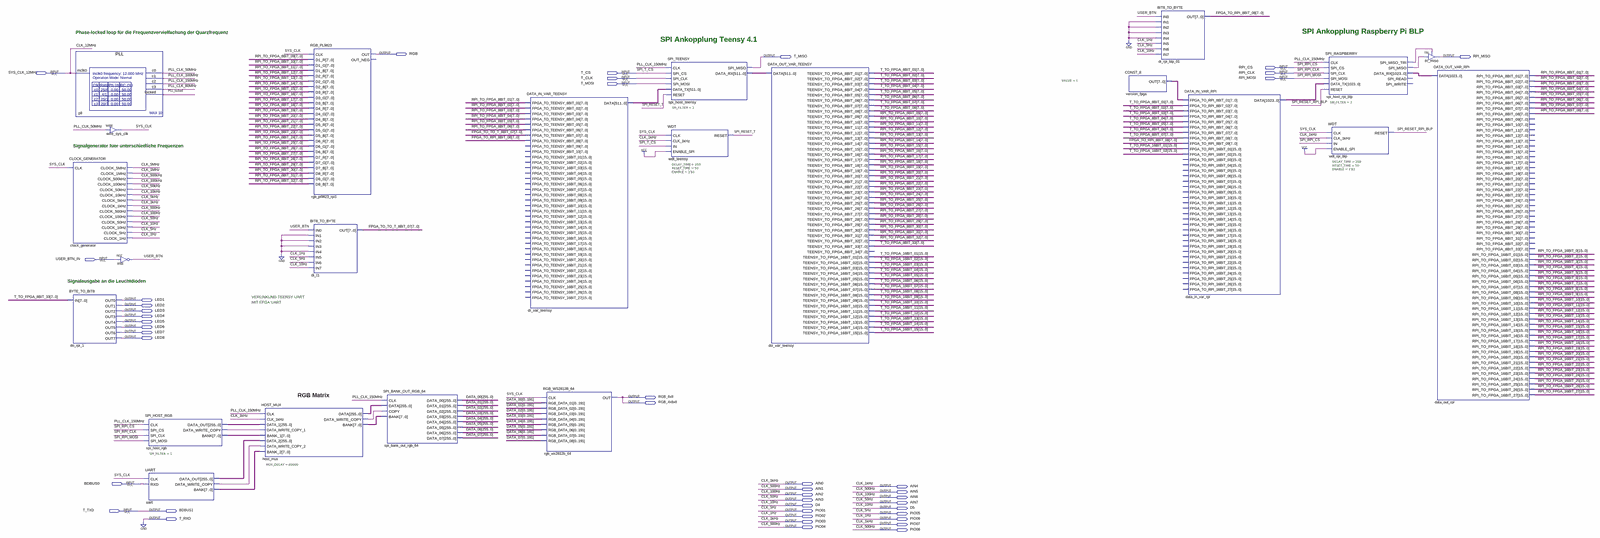
[diagram p0: schematic sheet, whole]
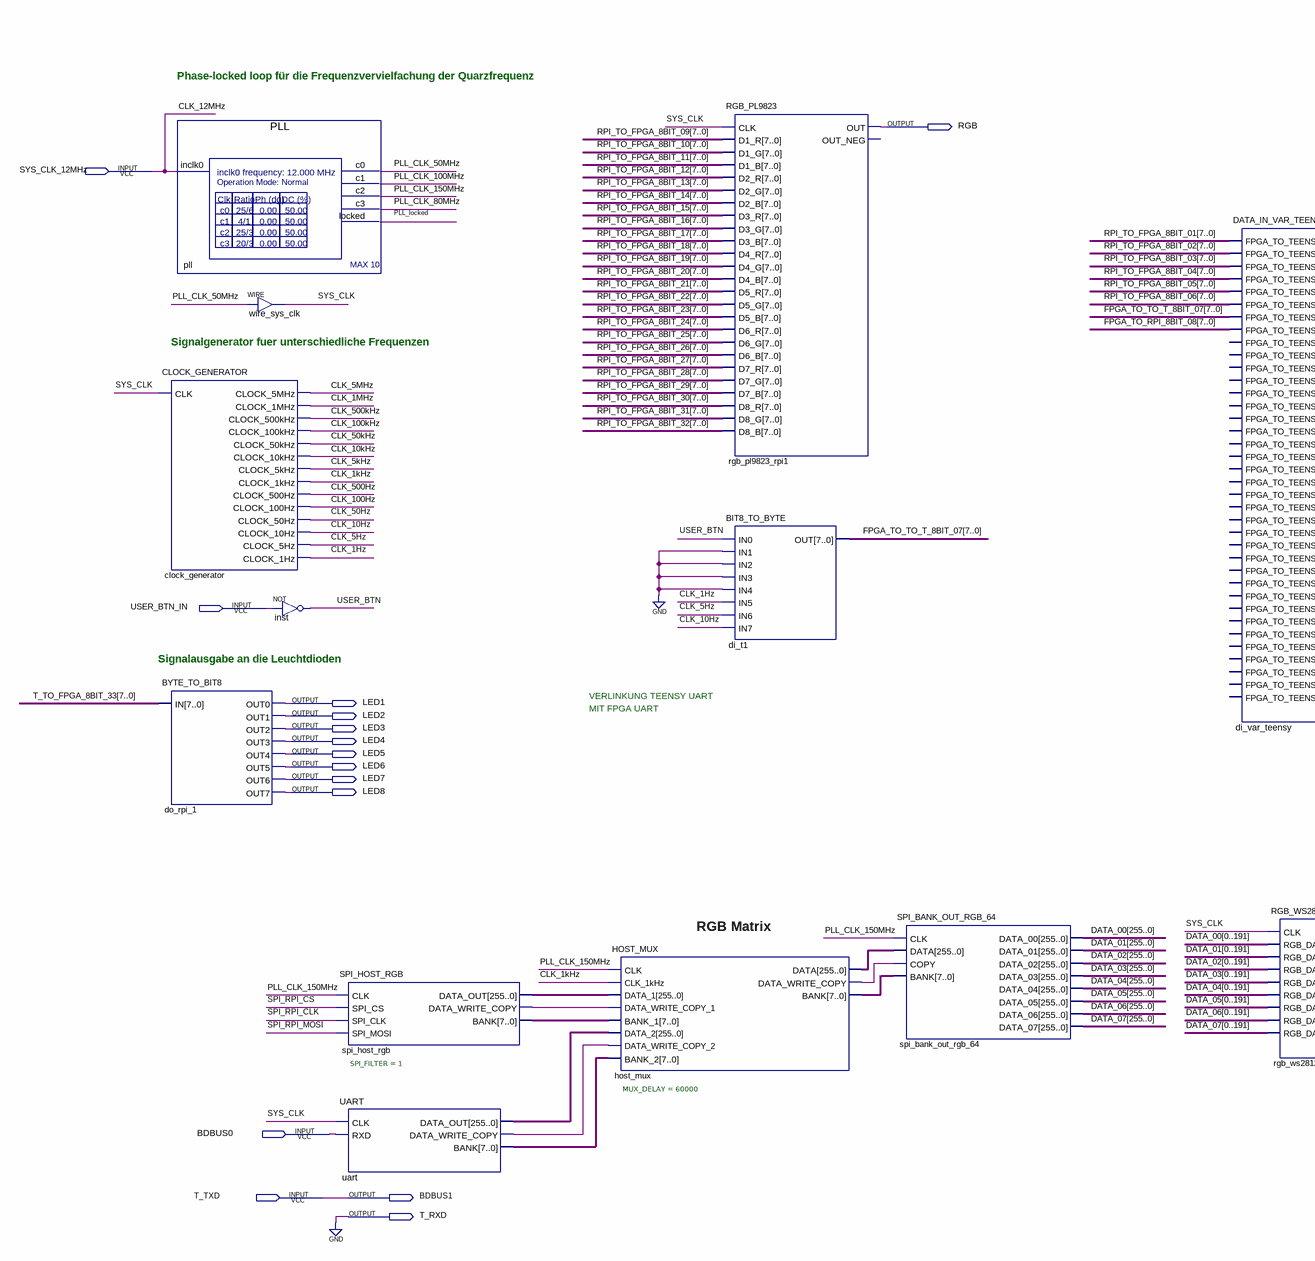
[diagram p1: schematic sheet, left part]
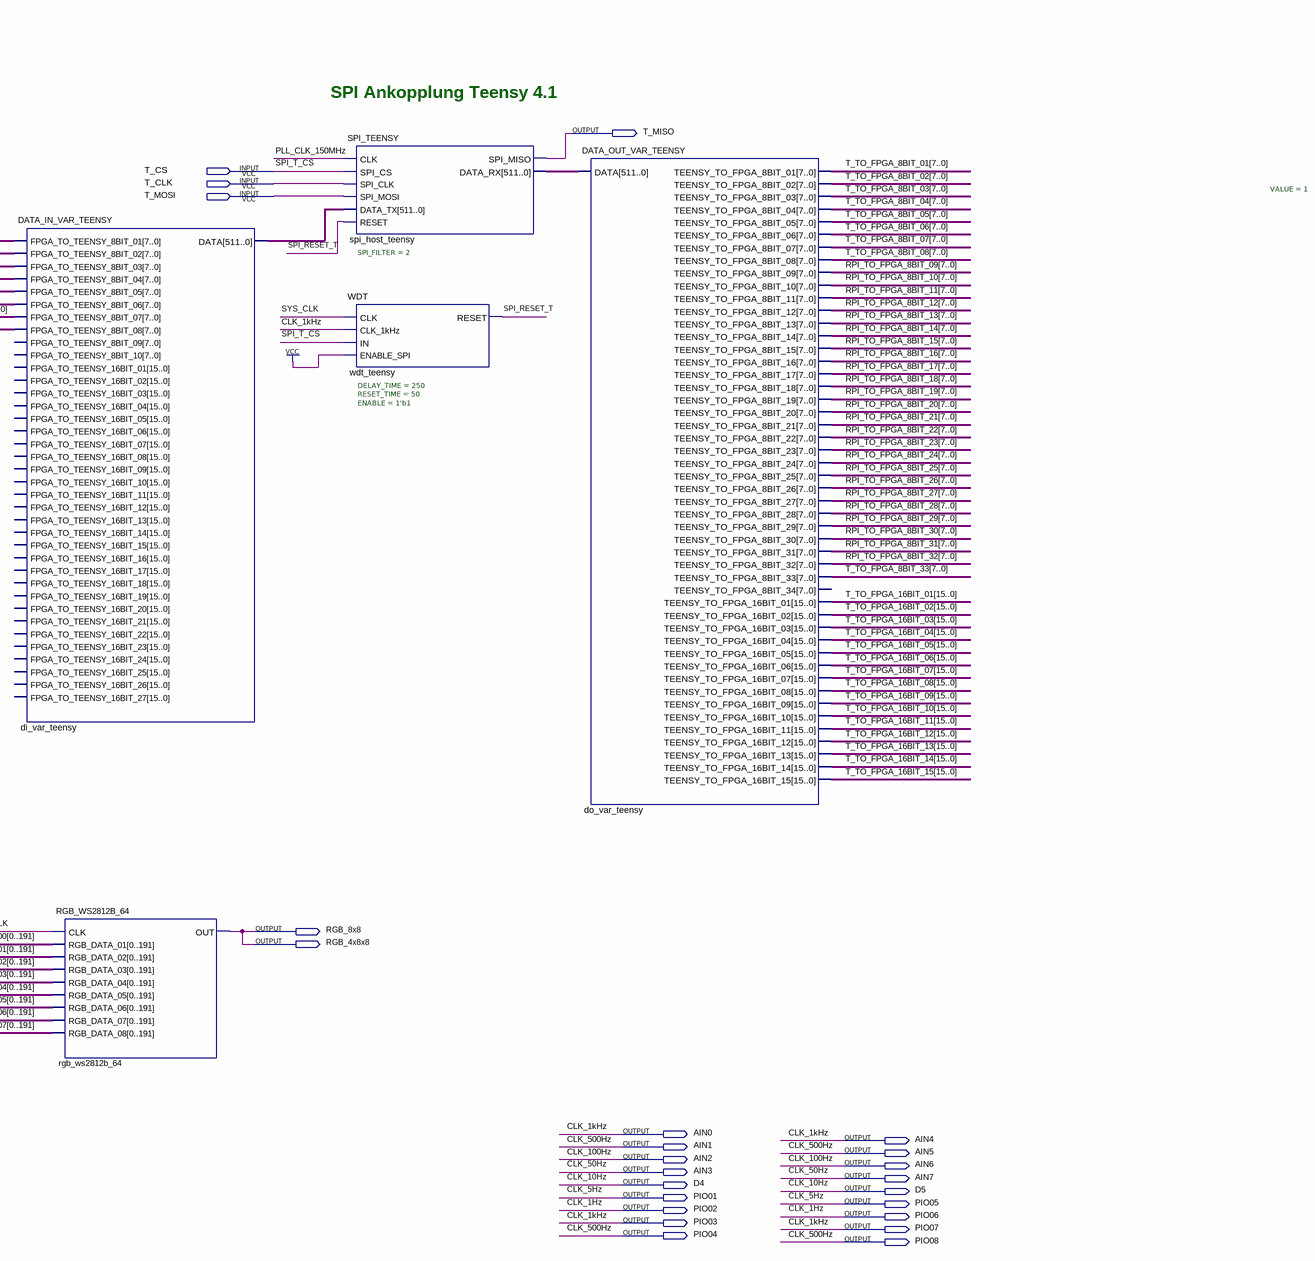
[diagram p2: schematic sheet, centre part]
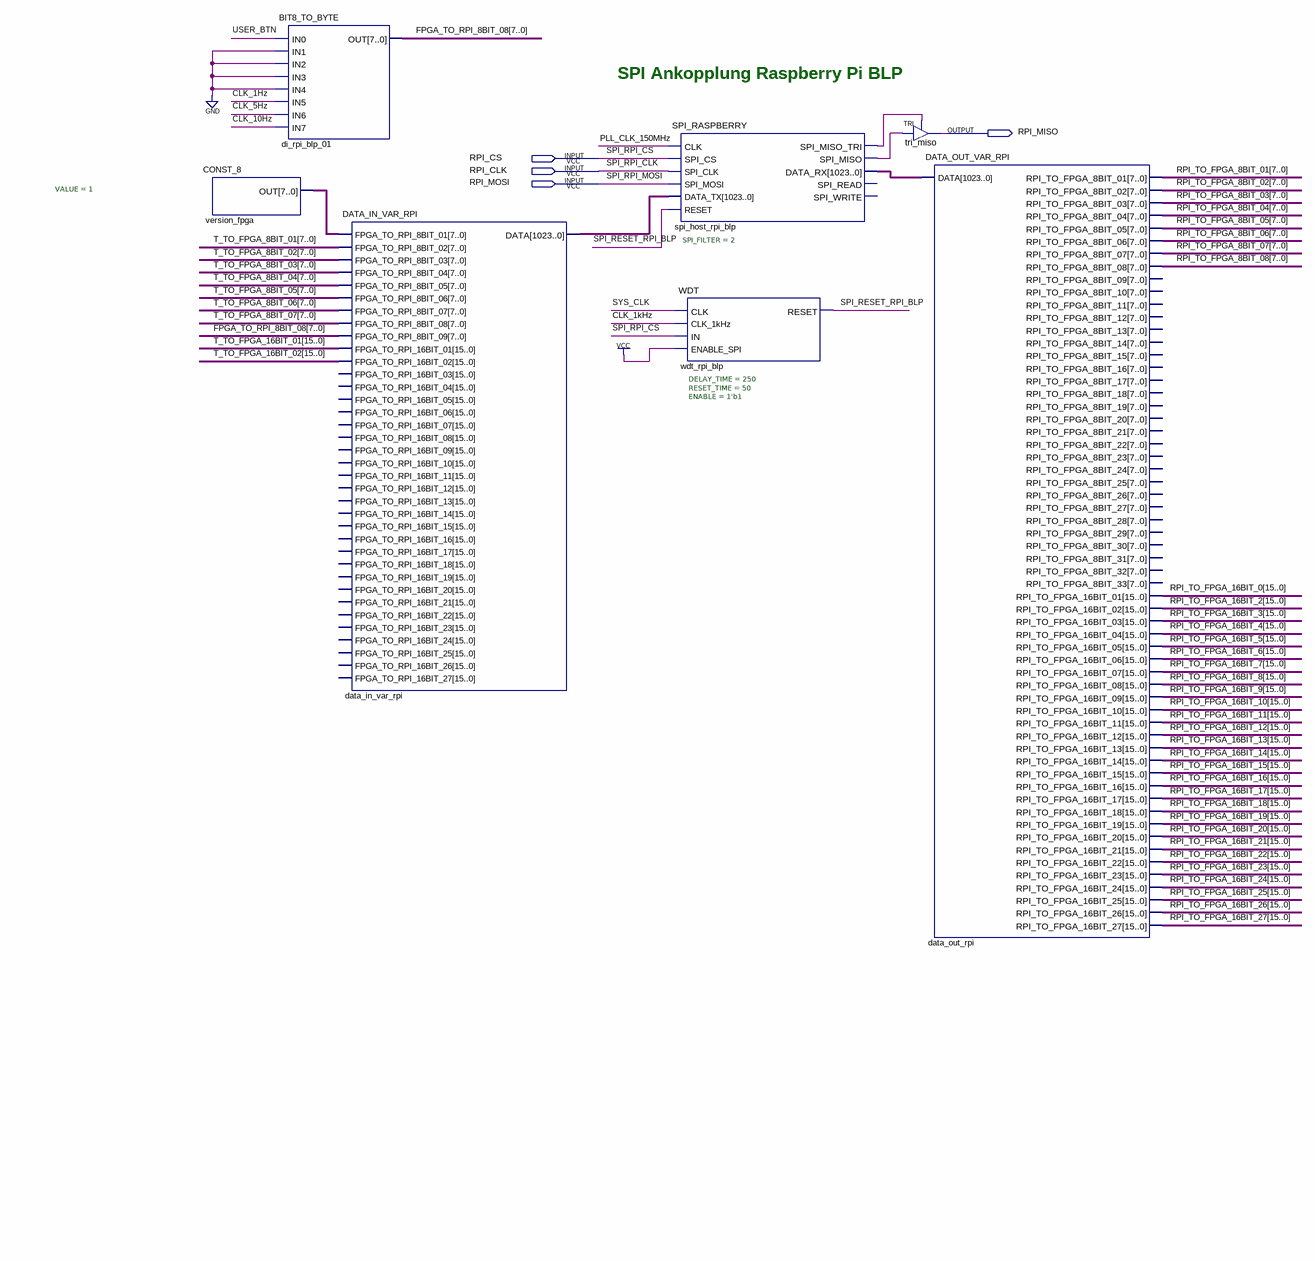
[diagram p3: schematic sheet, right part]
// Quartus schematic MAX1000.bdf as structural Verilog: 23 symbols, 43 pins
module MAX1000 (
  input  RPI_CS,
  input  SYS_CLK_12MHz,
  input  T_CS,
  input  RPI_CLK,
  input  T_CLK,
  input  RPI_MOSI,
  input  T_MOSI,
  input  USER_BTN_IN,
  input  BDBUS0,
  input  T_TXD,
  output RGB,
  output T_MISO,
  output RPI_MISO,
  output LED1,
  output LED2,
  output LED3,
  output LED4,
  output LED5,
  output LED6,
  output LED7,
  output LED8,
  output RGB_8x8,
  output RGB_4x8x8,
  output AIN0,
  output AIN4,
  output AIN1,
  output AIN5,
  output AIN2,
  output AIN6,
  output AIN3,
  output AIN7,
  output D4,
  output D5,
  output BDBUS1,
  output PIO01,
  output PIO05,
  output PIO02,
  output T_RXD,
  output PIO06,
  output PIO03,
  output PIO07,
  output PIO04,
  output PIO08
);

  wire CLK_1MHz, CLK_5kHz, CLK_5MHz, CLK_10kHz, CLK_50kHz, CLK_100kHz, CLK_500kHz, host_mux_data_write_copy,
       PLL_CLK_50MHz, PLL_CLK_80MHz, PLL_CLK_100MHz, PLL_CLK_150MHz, PLL_locked,
       spi_host_rgb_data_write_copy, spi_host_rpi_blp_spi_miso, spi_host_rpi_blp_spi_miso_tri,
       SPI_RESET_RPI_BLP, SPI_RESET_T, SYS_CLK, uart_data_write_copy, USER_BTN;
  wire [7:0] FPGA_TO_RPI_8BIT_08, FPGA_TO_TO_T_8BIT_07, host_mux_bank, RPI_TO_FPGA_8BIT_01,
       RPI_TO_FPGA_8BIT_02, RPI_TO_FPGA_8BIT_03, RPI_TO_FPGA_8BIT_04, RPI_TO_FPGA_8BIT_05,
       RPI_TO_FPGA_8BIT_06, RPI_TO_FPGA_8BIT_07, RPI_TO_FPGA_8BIT_08, RPI_TO_FPGA_8BIT_09,
       RPI_TO_FPGA_8BIT_10, RPI_TO_FPGA_8BIT_11, RPI_TO_FPGA_8BIT_12, RPI_TO_FPGA_8BIT_13,
       RPI_TO_FPGA_8BIT_14, RPI_TO_FPGA_8BIT_15, RPI_TO_FPGA_8BIT_16, RPI_TO_FPGA_8BIT_17,
       RPI_TO_FPGA_8BIT_18, RPI_TO_FPGA_8BIT_19, RPI_TO_FPGA_8BIT_20, RPI_TO_FPGA_8BIT_21,
       RPI_TO_FPGA_8BIT_22, RPI_TO_FPGA_8BIT_23, RPI_TO_FPGA_8BIT_24, RPI_TO_FPGA_8BIT_25,
       RPI_TO_FPGA_8BIT_26, RPI_TO_FPGA_8BIT_27, RPI_TO_FPGA_8BIT_28, RPI_TO_FPGA_8BIT_29,
       RPI_TO_FPGA_8BIT_30, RPI_TO_FPGA_8BIT_31, RPI_TO_FPGA_8BIT_32, spi_host_rgb_bank, T_TO_FPGA_8BIT_01,
       T_TO_FPGA_8BIT_02, T_TO_FPGA_8BIT_03, T_TO_FPGA_8BIT_04, T_TO_FPGA_8BIT_05, T_TO_FPGA_8BIT_06,
       T_TO_FPGA_8BIT_07, T_TO_FPGA_8BIT_08, T_TO_FPGA_8BIT_33, uart_bank, version_fpga_out;
  wire [15:0] RPI_TO_FPGA_16BIT_0, RPI_TO_FPGA_16BIT_2, RPI_TO_FPGA_16BIT_3, RPI_TO_FPGA_16BIT_4,
       RPI_TO_FPGA_16BIT_5, RPI_TO_FPGA_16BIT_6, RPI_TO_FPGA_16BIT_7, RPI_TO_FPGA_16BIT_8,
       RPI_TO_FPGA_16BIT_9, RPI_TO_FPGA_16BIT_10, RPI_TO_FPGA_16BIT_11, RPI_TO_FPGA_16BIT_12,
       RPI_TO_FPGA_16BIT_13, RPI_TO_FPGA_16BIT_14, RPI_TO_FPGA_16BIT_15, RPI_TO_FPGA_16BIT_16,
       RPI_TO_FPGA_16BIT_17, RPI_TO_FPGA_16BIT_18, RPI_TO_FPGA_16BIT_19, RPI_TO_FPGA_16BIT_20,
       RPI_TO_FPGA_16BIT_21, RPI_TO_FPGA_16BIT_22, RPI_TO_FPGA_16BIT_23, RPI_TO_FPGA_16BIT_24,
       RPI_TO_FPGA_16BIT_25, RPI_TO_FPGA_16BIT_26, RPI_TO_FPGA_16BIT_27, T_TO_FPGA_16BIT_01,
       T_TO_FPGA_16BIT_02, T_TO_FPGA_16BIT_03, T_TO_FPGA_16BIT_04, T_TO_FPGA_16BIT_05, T_TO_FPGA_16BIT_06,
       T_TO_FPGA_16BIT_07, T_TO_FPGA_16BIT_08, T_TO_FPGA_16BIT_09, T_TO_FPGA_16BIT_10, T_TO_FPGA_16BIT_11,
       T_TO_FPGA_16BIT_12, T_TO_FPGA_16BIT_13, T_TO_FPGA_16BIT_14, T_TO_FPGA_16BIT_15;
  wire [255:0] DATA_00, DATA_01, DATA_02, DATA_03, DATA_04, DATA_05, DATA_06, DATA_07, host_mux_data,
       spi_host_rgb_data_out, uart_data_out;
  wire [511:0] di_var_teensy_data, spi_host_teensy_data_rx;
  wire [1023:0] data_in_var_rpi_data, spi_host_rpi_blp_data_rx;

  PLL pll (
    .inclk0(SYS_CLK_12MHz), .c0(PLL_CLK_50MHz), .c1(PLL_CLK_100MHz), .c2(PLL_CLK_150MHz), .c3(PLL_CLK_80MHz),
    .locked(PLL_locked));
  CLOCK_GENERATOR clock_generator (
    .CLK(SYS_CLK), .CLOCK_5MHz(CLK_5MHz), .CLOCK_1MHz(CLK_1MHz), .CLOCK_500kHz(CLK_500kHz),
    .CLOCK_100kHz(CLK_100kHz), .CLOCK_50kHz(CLK_50kHz), .CLOCK_10kHz(CLK_10kHz), .CLOCK_5kHz(CLK_5kHz),
    .CLOCK_1kHz(AIN0), .CLOCK_500Hz(AIN1), .CLOCK_100Hz(AIN2), .CLOCK_50Hz(AIN3), .CLOCK_10Hz(D4),
    .CLOCK_5Hz(PIO01), .CLOCK_1Hz(PIO02));
  BYTE_TO_BIT8 do_rpi_1 (
    .IN(T_TO_FPGA_8BIT_33), .OUT0(LED1), .OUT1(LED2), .OUT2(LED3), .OUT3(LED4), .OUT4(LED5), .OUT5(LED6),
    .OUT6(LED7), .OUT7(LED8));
  assign SYS_CLK = PLL_CLK_50MHz;  // WIRE wire_sys_clk
  not inst (USER_BTN, USER_BTN_IN);
  SPI_HOST_RGB #(.SPI_FILTER(1)) spi_host_rgb (
    .CLK(PLL_CLK_150MHz), .SPI_CS(RPI_CS), .SPI_CLK(RPI_CLK), .SPI_MOSI(RPI_MOSI),
    .DATA_OUT(spi_host_rgb_data_out), .DATA_WRITE_COPY(spi_host_rgb_data_write_copy), .BANK(spi_host_rgb_bank));
  UART uart (
    .CLK(SYS_CLK), .RXD(BDBUS0), .DATA_OUT(uart_data_out), .DATA_WRITE_COPY(uart_data_write_copy),
    .BANK(uart_bank));
  HOST_MUX #(.MUX_DELAY(60000)) host_mux (
    .CLK(PLL_CLK_150MHz), .CLK_1kHz(AIN0), .DATA_1(spi_host_rgb_data_out),
    .DATA_WRITE_COPY_1(spi_host_rgb_data_write_copy), .BANK_1(spi_host_rgb_bank), .DATA_2(uart_data_out),
    .DATA_WRITE_COPY_2(uart_data_write_copy), .BANK_2(uart_bank), .DATA(host_mux_data),
    .DATA_WRITE_COPY(host_mux_data_write_copy), .BANK(host_mux_bank));
  RGB_PL9823 rgb_pl9823_rpi1 (
    .CLK(SYS_CLK), .D1_R(RPI_TO_FPGA_8BIT_09), .D1_G(RPI_TO_FPGA_8BIT_10), .D1_B(RPI_TO_FPGA_8BIT_11),
    .D2_R(RPI_TO_FPGA_8BIT_12), .D2_G(RPI_TO_FPGA_8BIT_13), .D2_B(RPI_TO_FPGA_8BIT_14),
    .D3_R(RPI_TO_FPGA_8BIT_15), .D3_G(RPI_TO_FPGA_8BIT_16), .D3_B(RPI_TO_FPGA_8BIT_17),
    .D4_R(RPI_TO_FPGA_8BIT_18), .D4_G(RPI_TO_FPGA_8BIT_19), .D4_B(RPI_TO_FPGA_8BIT_20),
    .D5_R(RPI_TO_FPGA_8BIT_21), .D5_G(RPI_TO_FPGA_8BIT_22), .D5_B(RPI_TO_FPGA_8BIT_23),
    .D6_R(RPI_TO_FPGA_8BIT_24), .D6_G(RPI_TO_FPGA_8BIT_25), .D6_B(RPI_TO_FPGA_8BIT_26),
    .D7_R(RPI_TO_FPGA_8BIT_27), .D7_G(RPI_TO_FPGA_8BIT_28), .D7_B(RPI_TO_FPGA_8BIT_29),
    .D8_R(RPI_TO_FPGA_8BIT_30), .D8_G(RPI_TO_FPGA_8BIT_31), .D8_B(RPI_TO_FPGA_8BIT_32), .OUT(RGB));  // open: OUT_NEG
  BIT8_TO_BYTE di_t1 (
    .IN0(USER_BTN), .IN1(1'b0), .IN2(1'b0), .IN3(1'b0), .IN4(1'b0), .IN5(PIO02), .IN6(PIO01), .IN7(D4),
    .OUT(FPGA_TO_TO_T_8BIT_07));
  SPI_BANK_OUT_RGB_64 spi_bank_out_rgb_64 (
    .CLK(PLL_CLK_150MHz), .DATA(host_mux_data), .COPY(host_mux_data_write_copy), .BANK(host_mux_bank),
    .DATA_00(DATA_00), .DATA_01(DATA_01), .DATA_02(DATA_02), .DATA_03(DATA_03), .DATA_04(DATA_04),
    .DATA_05(DATA_05), .DATA_06(DATA_06), .DATA_07(DATA_07));
  DATA_IN_VAR_TEENSY di_var_teensy (
    .FPGA_TO_TEENSY_8BIT_01(RPI_TO_FPGA_8BIT_01), .FPGA_TO_TEENSY_8BIT_02(RPI_TO_FPGA_8BIT_02),
    .FPGA_TO_TEENSY_8BIT_03(RPI_TO_FPGA_8BIT_03), .FPGA_TO_TEENSY_8BIT_04(RPI_TO_FPGA_8BIT_04),
    .FPGA_TO_TEENSY_8BIT_05(RPI_TO_FPGA_8BIT_05), .FPGA_TO_TEENSY_8BIT_06(RPI_TO_FPGA_8BIT_06),
    .FPGA_TO_TEENSY_8BIT_07(FPGA_TO_TO_T_8BIT_07), .FPGA_TO_TEENSY_8BIT_08(FPGA_TO_RPI_8BIT_08),
    .DATA(di_var_teensy_data));  // open: FPGA_TO_TEENSY_8BIT_09, FPGA_TO_TEENSY_8BIT_10, FPGA_TO_TEENSY_16BIT_01, FPGA_TO_TEENSY_16BIT_02, FPGA_TO_TEENSY_16BIT_03, FPGA_TO_TEENSY_16BIT_04, FPGA_TO_TEENSY_16BIT_05, FPGA_TO_TEENSY_16BIT_06, FPGA_TO_TEENSY_16BIT_07, FPGA_TO_TEENSY_16BIT_08, FPGA_TO_TEENSY_16BIT_09, FPGA_TO_TEENSY_16BIT_10, FPGA_TO_TEENSY_16BIT_11, FPGA_TO_TEENSY_16BIT_12, FPGA_TO_TEENSY_16BIT_13, FPGA_TO_TEENSY_16BIT_14, FPGA_TO_TEENSY_16BIT_15, FPGA_TO_TEENSY_16BIT_16, FPGA_TO_TEENSY_16BIT_17, FPGA_TO_TEENSY_16BIT_18, FPGA_TO_TEENSY_16BIT_19, FPGA_TO_TEENSY_16BIT_20, FPGA_TO_TEENSY_16BIT_21, FPGA_TO_TEENSY_16BIT_22, FPGA_TO_TEENSY_16BIT_23, FPGA_TO_TEENSY_16BIT_24, FPGA_TO_TEENSY_16BIT_25, FPGA_TO_TEENSY_16BIT_26, FPGA_TO_TEENSY_16BIT_27
  RGB_WS2812B_64 rgb_ws2812b_64 (
    .CLK(SYS_CLK),
    .RGB_DATA_01({DATA_00[0], DATA_00[1], DATA_00[2], DATA_00[3], DATA_00[4], DATA_00[5], DATA_00[6], DATA_00[7], DATA_00[8], DATA_00[9], DATA_00[10], DATA_00[11], DATA_00[12], DATA_00[13], DATA_00[14], DATA_00[15], DATA_00[16], DATA_00[17], DATA_00[18], DATA_00[19], DATA_00[20], DATA_00[21], DATA_00[22], DATA_00[23], DATA_00[24], DATA_00[25], DATA_00[26], DATA_00[27], DATA_00[28], DATA_00[29], DATA_00[30], DATA_00[31], DATA_00[32], DATA_00[33], DATA_00[34], DATA_00[35], DATA_00[36], DATA_00[37], DATA_00[38], DATA_00[39], DATA_00[40], DATA_00[41], DATA_00[42], DATA_00[43], DATA_00[44], DATA_00[45], DATA_00[46], DATA_00[47], DATA_00[48], DATA_00[49], DATA_00[50], DATA_00[51], DATA_00[52], DATA_00[53], DATA_00[54], DATA_00[55], DATA_00[56], DATA_00[57], DATA_00[58], DATA_00[59], DATA_00[60], DATA_00[61], DATA_00[62], DATA_00[63], DATA_00[64], DATA_00[65], DATA_00[66], DATA_00[67], DATA_00[68], DATA_00[69], DATA_00[70], DATA_00[71], DATA_00[72], DATA_00[73], DATA_00[74], DATA_00[75], DATA_00[76], DATA_00[77], DATA_00[78], DATA_00[79], DATA_00[80], DATA_00[81], DATA_00[82], DATA_00[83], DATA_00[84], DATA_00[85], DATA_00[86], DATA_00[87], DATA_00[88], DATA_00[89], DATA_00[90], DATA_00[91], DATA_00[92], DATA_00[93], DATA_00[94], DATA_00[95], DATA_00[96], DATA_00[97], DATA_00[98], DATA_00[99], DATA_00[100], DATA_00[101], DATA_00[102], DATA_00[103], DATA_00[104], DATA_00[105], DATA_00[106], DATA_00[107], DATA_00[108], DATA_00[109], DATA_00[110], DATA_00[111], DATA_00[112], DATA_00[113], DATA_00[114], DATA_00[115], DATA_00[116], DATA_00[117], DATA_00[118], DATA_00[119], DATA_00[120], DATA_00[121], DATA_00[122], DATA_00[123], DATA_00[124], DATA_00[125], DATA_00[126], DATA_00[127], DATA_00[128], DATA_00[129], DATA_00[130], DATA_00[131], DATA_00[132], DATA_00[133], DATA_00[134], DATA_00[135], DATA_00[136], DATA_00[137], DATA_00[138], DATA_00[139], DATA_00[140], DATA_00[141], DATA_00[142], DATA_00[143], DATA_00[144], DATA_00[145], DATA_00[146], DATA_00[147], DATA_00[148], DATA_00[149], DATA_00[150], DATA_00[151], DATA_00[152], DATA_00[153], DATA_00[154], DATA_00[155], DATA_00[156], DATA_00[157], DATA_00[158], DATA_00[159], DATA_00[160], DATA_00[161], DATA_00[162], DATA_00[163], DATA_00[164], DATA_00[165], DATA_00[166], DATA_00[167], DATA_00[168], DATA_00[169], DATA_00[170], DATA_00[171], DATA_00[172], DATA_00[173], DATA_00[174], DATA_00[175], DATA_00[176], DATA_00[177], DATA_00[178], DATA_00[179], DATA_00[180], DATA_00[181], DATA_00[182], DATA_00[183], DATA_00[184], DATA_00[185], DATA_00[186], DATA_00[187], DATA_00[188], DATA_00[189], DATA_00[190], DATA_00[191]}),
    .RGB_DATA_02({DATA_01[0], DATA_01[1], DATA_01[2], DATA_01[3], DATA_01[4], DATA_01[5], DATA_01[6], DATA_01[7], DATA_01[8], DATA_01[9], DATA_01[10], DATA_01[11], DATA_01[12], DATA_01[13], DATA_01[14], DATA_01[15], DATA_01[16], DATA_01[17], DATA_01[18], DATA_01[19], DATA_01[20], DATA_01[21], DATA_01[22], DATA_01[23], DATA_01[24], DATA_01[25], DATA_01[26], DATA_01[27], DATA_01[28], DATA_01[29], DATA_01[30], DATA_01[31], DATA_01[32], DATA_01[33], DATA_01[34], DATA_01[35], DATA_01[36], DATA_01[37], DATA_01[38], DATA_01[39], DATA_01[40], DATA_01[41], DATA_01[42], DATA_01[43], DATA_01[44], DATA_01[45], DATA_01[46], DATA_01[47], DATA_01[48], DATA_01[49], DATA_01[50], DATA_01[51], DATA_01[52], DATA_01[53], DATA_01[54], DATA_01[55], DATA_01[56], DATA_01[57], DATA_01[58], DATA_01[59], DATA_01[60], DATA_01[61], DATA_01[62], DATA_01[63], DATA_01[64], DATA_01[65], DATA_01[66], DATA_01[67], DATA_01[68], DATA_01[69], DATA_01[70], DATA_01[71], DATA_01[72], DATA_01[73], DATA_01[74], DATA_01[75], DATA_01[76], DATA_01[77], DATA_01[78], DATA_01[79], DATA_01[80], DATA_01[81], DATA_01[82], DATA_01[83], DATA_01[84], DATA_01[85], DATA_01[86], DATA_01[87], DATA_01[88], DATA_01[89], DATA_01[90], DATA_01[91], DATA_01[92], DATA_01[93], DATA_01[94], DATA_01[95], DATA_01[96], DATA_01[97], DATA_01[98], DATA_01[99], DATA_01[100], DATA_01[101], DATA_01[102], DATA_01[103], DATA_01[104], DATA_01[105], DATA_01[106], DATA_01[107], DATA_01[108], DATA_01[109], DATA_01[110], DATA_01[111], DATA_01[112], DATA_01[113], DATA_01[114], DATA_01[115], DATA_01[116], DATA_01[117], DATA_01[118], DATA_01[119], DATA_01[120], DATA_01[121], DATA_01[122], DATA_01[123], DATA_01[124], DATA_01[125], DATA_01[126], DATA_01[127], DATA_01[128], DATA_01[129], DATA_01[130], DATA_01[131], DATA_01[132], DATA_01[133], DATA_01[134], DATA_01[135], DATA_01[136], DATA_01[137], DATA_01[138], DATA_01[139], DATA_01[140], DATA_01[141], DATA_01[142], DATA_01[143], DATA_01[144], DATA_01[145], DATA_01[146], DATA_01[147], DATA_01[148], DATA_01[149], DATA_01[150], DATA_01[151], DATA_01[152], DATA_01[153], DATA_01[154], DATA_01[155], DATA_01[156], DATA_01[157], DATA_01[158], DATA_01[159], DATA_01[160], DATA_01[161], DATA_01[162], DATA_01[163], DATA_01[164], DATA_01[165], DATA_01[166], DATA_01[167], DATA_01[168], DATA_01[169], DATA_01[170], DATA_01[171], DATA_01[172], DATA_01[173], DATA_01[174], DATA_01[175], DATA_01[176], DATA_01[177], DATA_01[178], DATA_01[179], DATA_01[180], DATA_01[181], DATA_01[182], DATA_01[183], DATA_01[184], DATA_01[185], DATA_01[186], DATA_01[187], DATA_01[188], DATA_01[189], DATA_01[190], DATA_01[191]}),
    .RGB_DATA_03({DATA_02[0], DATA_02[1], DATA_02[2], DATA_02[3], DATA_02[4], DATA_02[5], DATA_02[6], DATA_02[7], DATA_02[8], DATA_02[9], DATA_02[10], DATA_02[11], DATA_02[12], DATA_02[13], DATA_02[14], DATA_02[15], DATA_02[16], DATA_02[17], DATA_02[18], DATA_02[19], DATA_02[20], DATA_02[21], DATA_02[22], DATA_02[23], DATA_02[24], DATA_02[25], DATA_02[26], DATA_02[27], DATA_02[28], DATA_02[29], DATA_02[30], DATA_02[31], DATA_02[32], DATA_02[33], DATA_02[34], DATA_02[35], DATA_02[36], DATA_02[37], DATA_02[38], DATA_02[39], DATA_02[40], DATA_02[41], DATA_02[42], DATA_02[43], DATA_02[44], DATA_02[45], DATA_02[46], DATA_02[47], DATA_02[48], DATA_02[49], DATA_02[50], DATA_02[51], DATA_02[52], DATA_02[53], DATA_02[54], DATA_02[55], DATA_02[56], DATA_02[57], DATA_02[58], DATA_02[59], DATA_02[60], DATA_02[61], DATA_02[62], DATA_02[63], DATA_02[64], DATA_02[65], DATA_02[66], DATA_02[67], DATA_02[68], DATA_02[69], DATA_02[70], DATA_02[71], DATA_02[72], DATA_02[73], DATA_02[74], DATA_02[75], DATA_02[76], DATA_02[77], DATA_02[78], DATA_02[79], DATA_02[80], DATA_02[81], DATA_02[82], DATA_02[83], DATA_02[84], DATA_02[85], DATA_02[86], DATA_02[87], DATA_02[88], DATA_02[89], DATA_02[90], DATA_02[91], DATA_02[92], DATA_02[93], DATA_02[94], DATA_02[95], DATA_02[96], DATA_02[97], DATA_02[98], DATA_02[99], DATA_02[100], DATA_02[101], DATA_02[102], DATA_02[103], DATA_02[104], DATA_02[105], DATA_02[106], DATA_02[107], DATA_02[108], DATA_02[109], DATA_02[110], DATA_02[111], DATA_02[112], DATA_02[113], DATA_02[114], DATA_02[115], DATA_02[116], DATA_02[117], DATA_02[118], DATA_02[119], DATA_02[120], DATA_02[121], DATA_02[122], DATA_02[123], DATA_02[124], DATA_02[125], DATA_02[126], DATA_02[127], DATA_02[128], DATA_02[129], DATA_02[130], DATA_02[131], DATA_02[132], DATA_02[133], DATA_02[134], DATA_02[135], DATA_02[136], DATA_02[137], DATA_02[138], DATA_02[139], DATA_02[140], DATA_02[141], DATA_02[142], DATA_02[143], DATA_02[144], DATA_02[145], DATA_02[146], DATA_02[147], DATA_02[148], DATA_02[149], DATA_02[150], DATA_02[151], DATA_02[152], DATA_02[153], DATA_02[154], DATA_02[155], DATA_02[156], DATA_02[157], DATA_02[158], DATA_02[159], DATA_02[160], DATA_02[161], DATA_02[162], DATA_02[163], DATA_02[164], DATA_02[165], DATA_02[166], DATA_02[167], DATA_02[168], DATA_02[169], DATA_02[170], DATA_02[171], DATA_02[172], DATA_02[173], DATA_02[174], DATA_02[175], DATA_02[176], DATA_02[177], DATA_02[178], DATA_02[179], DATA_02[180], DATA_02[181], DATA_02[182], DATA_02[183], DATA_02[184], DATA_02[185], DATA_02[186], DATA_02[187], DATA_02[188], DATA_02[189], DATA_02[190], DATA_02[191]}),
    .RGB_DATA_04({DATA_03[0], DATA_03[1], DATA_03[2], DATA_03[3], DATA_03[4], DATA_03[5], DATA_03[6], DATA_03[7], DATA_03[8], DATA_03[9], DATA_03[10], DATA_03[11], DATA_03[12], DATA_03[13], DATA_03[14], DATA_03[15], DATA_03[16], DATA_03[17], DATA_03[18], DATA_03[19], DATA_03[20], DATA_03[21], DATA_03[22], DATA_03[23], DATA_03[24], DATA_03[25], DATA_03[26], DATA_03[27], DATA_03[28], DATA_03[29], DATA_03[30], DATA_03[31], DATA_03[32], DATA_03[33], DATA_03[34], DATA_03[35], DATA_03[36], DATA_03[37], DATA_03[38], DATA_03[39], DATA_03[40], DATA_03[41], DATA_03[42], DATA_03[43], DATA_03[44], DATA_03[45], DATA_03[46], DATA_03[47], DATA_03[48], DATA_03[49], DATA_03[50], DATA_03[51], DATA_03[52], DATA_03[53], DATA_03[54], DATA_03[55], DATA_03[56], DATA_03[57], DATA_03[58], DATA_03[59], DATA_03[60], DATA_03[61], DATA_03[62], DATA_03[63], DATA_03[64], DATA_03[65], DATA_03[66], DATA_03[67], DATA_03[68], DATA_03[69], DATA_03[70], DATA_03[71], DATA_03[72], DATA_03[73], DATA_03[74], DATA_03[75], DATA_03[76], DATA_03[77], DATA_03[78], DATA_03[79], DATA_03[80], DATA_03[81], DATA_03[82], DATA_03[83], DATA_03[84], DATA_03[85], DATA_03[86], DATA_03[87], DATA_03[88], DATA_03[89], DATA_03[90], DATA_03[91], DATA_03[92], DATA_03[93], DATA_03[94], DATA_03[95], DATA_03[96], DATA_03[97], DATA_03[98], DATA_03[99], DATA_03[100], DATA_03[101], DATA_03[102], DATA_03[103], DATA_03[104], DATA_03[105], DATA_03[106], DATA_03[107], DATA_03[108], DATA_03[109], DATA_03[110], DATA_03[111], DATA_03[112], DATA_03[113], DATA_03[114], DATA_03[115], DATA_03[116], DATA_03[117], DATA_03[118], DATA_03[119], DATA_03[120], DATA_03[121], DATA_03[122], DATA_03[123], DATA_03[124], DATA_03[125], DATA_03[126], DATA_03[127], DATA_03[128], DATA_03[129], DATA_03[130], DATA_03[131], DATA_03[132], DATA_03[133], DATA_03[134], DATA_03[135], DATA_03[136], DATA_03[137], DATA_03[138], DATA_03[139], DATA_03[140], DATA_03[141], DATA_03[142], DATA_03[143], DATA_03[144], DATA_03[145], DATA_03[146], DATA_03[147], DATA_03[148], DATA_03[149], DATA_03[150], DATA_03[151], DATA_03[152], DATA_03[153], DATA_03[154], DATA_03[155], DATA_03[156], DATA_03[157], DATA_03[158], DATA_03[159], DATA_03[160], DATA_03[161], DATA_03[162], DATA_03[163], DATA_03[164], DATA_03[165], DATA_03[166], DATA_03[167], DATA_03[168], DATA_03[169], DATA_03[170], DATA_03[171], DATA_03[172], DATA_03[173], DATA_03[174], DATA_03[175], DATA_03[176], DATA_03[177], DATA_03[178], DATA_03[179], DATA_03[180], DATA_03[181], DATA_03[182], DATA_03[183], DATA_03[184], DATA_03[185], DATA_03[186], DATA_03[187], DATA_03[188], DATA_03[189], DATA_03[190], DATA_03[191]}),
    .RGB_DATA_05({DATA_04[0], DATA_04[1], DATA_04[2], DATA_04[3], DATA_04[4], DATA_04[5], DATA_04[6], DATA_04[7], DATA_04[8], DATA_04[9], DATA_04[10], DATA_04[11], DATA_04[12], DATA_04[13], DATA_04[14], DATA_04[15], DATA_04[16], DATA_04[17], DATA_04[18], DATA_04[19], DATA_04[20], DATA_04[21], DATA_04[22], DATA_04[23], DATA_04[24], DATA_04[25], DATA_04[26], DATA_04[27], DATA_04[28], DATA_04[29], DATA_04[30], DATA_04[31], DATA_04[32], DATA_04[33], DATA_04[34], DATA_04[35], DATA_04[36], DATA_04[37], DATA_04[38], DATA_04[39], DATA_04[40], DATA_04[41], DATA_04[42], DATA_04[43], DATA_04[44], DATA_04[45], DATA_04[46], DATA_04[47], DATA_04[48], DATA_04[49], DATA_04[50], DATA_04[51], DATA_04[52], DATA_04[53], DATA_04[54], DATA_04[55], DATA_04[56], DATA_04[57], DATA_04[58], DATA_04[59], DATA_04[60], DATA_04[61], DATA_04[62], DATA_04[63], DATA_04[64], DATA_04[65], DATA_04[66], DATA_04[67], DATA_04[68], DATA_04[69], DATA_04[70], DATA_04[71], DATA_04[72], DATA_04[73], DATA_04[74], DATA_04[75], DATA_04[76], DATA_04[77], DATA_04[78], DATA_04[79], DATA_04[80], DATA_04[81], DATA_04[82], DATA_04[83], DATA_04[84], DATA_04[85], DATA_04[86], DATA_04[87], DATA_04[88], DATA_04[89], DATA_04[90], DATA_04[91], DATA_04[92], DATA_04[93], DATA_04[94], DATA_04[95], DATA_04[96], DATA_04[97], DATA_04[98], DATA_04[99], DATA_04[100], DATA_04[101], DATA_04[102], DATA_04[103], DATA_04[104], DATA_04[105], DATA_04[106], DATA_04[107], DATA_04[108], DATA_04[109], DATA_04[110], DATA_04[111], DATA_04[112], DATA_04[113], DATA_04[114], DATA_04[115], DATA_04[116], DATA_04[117], DATA_04[118], DATA_04[119], DATA_04[120], DATA_04[121], DATA_04[122], DATA_04[123], DATA_04[124], DATA_04[125], DATA_04[126], DATA_04[127], DATA_04[128], DATA_04[129], DATA_04[130], DATA_04[131], DATA_04[132], DATA_04[133], DATA_04[134], DATA_04[135], DATA_04[136], DATA_04[137], DATA_04[138], DATA_04[139], DATA_04[140], DATA_04[141], DATA_04[142], DATA_04[143], DATA_04[144], DATA_04[145], DATA_04[146], DATA_04[147], DATA_04[148], DATA_04[149], DATA_04[150], DATA_04[151], DATA_04[152], DATA_04[153], DATA_04[154], DATA_04[155], DATA_04[156], DATA_04[157], DATA_04[158], DATA_04[159], DATA_04[160], DATA_04[161], DATA_04[162], DATA_04[163], DATA_04[164], DATA_04[165], DATA_04[166], DATA_04[167], DATA_04[168], DATA_04[169], DATA_04[170], DATA_04[171], DATA_04[172], DATA_04[173], DATA_04[174], DATA_04[175], DATA_04[176], DATA_04[177], DATA_04[178], DATA_04[179], DATA_04[180], DATA_04[181], DATA_04[182], DATA_04[183], DATA_04[184], DATA_04[185], DATA_04[186], DATA_04[187], DATA_04[188], DATA_04[189], DATA_04[190], DATA_04[191]}),
    .RGB_DATA_06({DATA_05[0], DATA_05[1], DATA_05[2], DATA_05[3], DATA_05[4], DATA_05[5], DATA_05[6], DATA_05[7], DATA_05[8], DATA_05[9], DATA_05[10], DATA_05[11], DATA_05[12], DATA_05[13], DATA_05[14], DATA_05[15], DATA_05[16], DATA_05[17], DATA_05[18], DATA_05[19], DATA_05[20], DATA_05[21], DATA_05[22], DATA_05[23], DATA_05[24], DATA_05[25], DATA_05[26], DATA_05[27], DATA_05[28], DATA_05[29], DATA_05[30], DATA_05[31], DATA_05[32], DATA_05[33], DATA_05[34], DATA_05[35], DATA_05[36], DATA_05[37], DATA_05[38], DATA_05[39], DATA_05[40], DATA_05[41], DATA_05[42], DATA_05[43], DATA_05[44], DATA_05[45], DATA_05[46], DATA_05[47], DATA_05[48], DATA_05[49], DATA_05[50], DATA_05[51], DATA_05[52], DATA_05[53], DATA_05[54], DATA_05[55], DATA_05[56], DATA_05[57], DATA_05[58], DATA_05[59], DATA_05[60], DATA_05[61], DATA_05[62], DATA_05[63], DATA_05[64], DATA_05[65], DATA_05[66], DATA_05[67], DATA_05[68], DATA_05[69], DATA_05[70], DATA_05[71], DATA_05[72], DATA_05[73], DATA_05[74], DATA_05[75], DATA_05[76], DATA_05[77], DATA_05[78], DATA_05[79], DATA_05[80], DATA_05[81], DATA_05[82], DATA_05[83], DATA_05[84], DATA_05[85], DATA_05[86], DATA_05[87], DATA_05[88], DATA_05[89], DATA_05[90], DATA_05[91], DATA_05[92], DATA_05[93], DATA_05[94], DATA_05[95], DATA_05[96], DATA_05[97], DATA_05[98], DATA_05[99], DATA_05[100], DATA_05[101], DATA_05[102], DATA_05[103], DATA_05[104], DATA_05[105], DATA_05[106], DATA_05[107], DATA_05[108], DATA_05[109], DATA_05[110], DATA_05[111], DATA_05[112], DATA_05[113], DATA_05[114], DATA_05[115], DATA_05[116], DATA_05[117], DATA_05[118], DATA_05[119], DATA_05[120], DATA_05[121], DATA_05[122], DATA_05[123], DATA_05[124], DATA_05[125], DATA_05[126], DATA_05[127], DATA_05[128], DATA_05[129], DATA_05[130], DATA_05[131], DATA_05[132], DATA_05[133], DATA_05[134], DATA_05[135], DATA_05[136], DATA_05[137], DATA_05[138], DATA_05[139], DATA_05[140], DATA_05[141], DATA_05[142], DATA_05[143], DATA_05[144], DATA_05[145], DATA_05[146], DATA_05[147], DATA_05[148], DATA_05[149], DATA_05[150], DATA_05[151], DATA_05[152], DATA_05[153], DATA_05[154], DATA_05[155], DATA_05[156], DATA_05[157], DATA_05[158], DATA_05[159], DATA_05[160], DATA_05[161], DATA_05[162], DATA_05[163], DATA_05[164], DATA_05[165], DATA_05[166], DATA_05[167], DATA_05[168], DATA_05[169], DATA_05[170], DATA_05[171], DATA_05[172], DATA_05[173], DATA_05[174], DATA_05[175], DATA_05[176], DATA_05[177], DATA_05[178], DATA_05[179], DATA_05[180], DATA_05[181], DATA_05[182], DATA_05[183], DATA_05[184], DATA_05[185], DATA_05[186], DATA_05[187], DATA_05[188], DATA_05[189], DATA_05[190], DATA_05[191]}),
    .RGB_DATA_07({DATA_06[0], DATA_06[1], DATA_06[2], DATA_06[3], DATA_06[4], DATA_06[5], DATA_06[6], DATA_06[7], DATA_06[8], DATA_06[9], DATA_06[10], DATA_06[11], DATA_06[12], DATA_06[13], DATA_06[14], DATA_06[15], DATA_06[16], DATA_06[17], DATA_06[18], DATA_06[19], DATA_06[20], DATA_06[21], DATA_06[22], DATA_06[23], DATA_06[24], DATA_06[25], DATA_06[26], DATA_06[27], DATA_06[28], DATA_06[29], DATA_06[30], DATA_06[31], DATA_06[32], DATA_06[33], DATA_06[34], DATA_06[35], DATA_06[36], DATA_06[37], DATA_06[38], DATA_06[39], DATA_06[40], DATA_06[41], DATA_06[42], DATA_06[43], DATA_06[44], DATA_06[45], DATA_06[46], DATA_06[47], DATA_06[48], DATA_06[49], DATA_06[50], DATA_06[51], DATA_06[52], DATA_06[53], DATA_06[54], DATA_06[55], DATA_06[56], DATA_06[57], DATA_06[58], DATA_06[59], DATA_06[60], DATA_06[61], DATA_06[62], DATA_06[63], DATA_06[64], DATA_06[65], DATA_06[66], DATA_06[67], DATA_06[68], DATA_06[69], DATA_06[70], DATA_06[71], DATA_06[72], DATA_06[73], DATA_06[74], DATA_06[75], DATA_06[76], DATA_06[77], DATA_06[78], DATA_06[79], DATA_06[80], DATA_06[81], DATA_06[82], DATA_06[83], DATA_06[84], DATA_06[85], DATA_06[86], DATA_06[87], DATA_06[88], DATA_06[89], DATA_06[90], DATA_06[91], DATA_06[92], DATA_06[93], DATA_06[94], DATA_06[95], DATA_06[96], DATA_06[97], DATA_06[98], DATA_06[99], DATA_06[100], DATA_06[101], DATA_06[102], DATA_06[103], DATA_06[104], DATA_06[105], DATA_06[106], DATA_06[107], DATA_06[108], DATA_06[109], DATA_06[110], DATA_06[111], DATA_06[112], DATA_06[113], DATA_06[114], DATA_06[115], DATA_06[116], DATA_06[117], DATA_06[118], DATA_06[119], DATA_06[120], DATA_06[121], DATA_06[122], DATA_06[123], DATA_06[124], DATA_06[125], DATA_06[126], DATA_06[127], DATA_06[128], DATA_06[129], DATA_06[130], DATA_06[131], DATA_06[132], DATA_06[133], DATA_06[134], DATA_06[135], DATA_06[136], DATA_06[137], DATA_06[138], DATA_06[139], DATA_06[140], DATA_06[141], DATA_06[142], DATA_06[143], DATA_06[144], DATA_06[145], DATA_06[146], DATA_06[147], DATA_06[148], DATA_06[149], DATA_06[150], DATA_06[151], DATA_06[152], DATA_06[153], DATA_06[154], DATA_06[155], DATA_06[156], DATA_06[157], DATA_06[158], DATA_06[159], DATA_06[160], DATA_06[161], DATA_06[162], DATA_06[163], DATA_06[164], DATA_06[165], DATA_06[166], DATA_06[167], DATA_06[168], DATA_06[169], DATA_06[170], DATA_06[171], DATA_06[172], DATA_06[173], DATA_06[174], DATA_06[175], DATA_06[176], DATA_06[177], DATA_06[178], DATA_06[179], DATA_06[180], DATA_06[181], DATA_06[182], DATA_06[183], DATA_06[184], DATA_06[185], DATA_06[186], DATA_06[187], DATA_06[188], DATA_06[189], DATA_06[190], DATA_06[191]}),
    .RGB_DATA_08({DATA_07[0], DATA_07[1], DATA_07[2], DATA_07[3], DATA_07[4], DATA_07[5], DATA_07[6], DATA_07[7], DATA_07[8], DATA_07[9], DATA_07[10], DATA_07[11], DATA_07[12], DATA_07[13], DATA_07[14], DATA_07[15], DATA_07[16], DATA_07[17], DATA_07[18], DATA_07[19], DATA_07[20], DATA_07[21], DATA_07[22], DATA_07[23], DATA_07[24], DATA_07[25], DATA_07[26], DATA_07[27], DATA_07[28], DATA_07[29], DATA_07[30], DATA_07[31], DATA_07[32], DATA_07[33], DATA_07[34], DATA_07[35], DATA_07[36], DATA_07[37], DATA_07[38], DATA_07[39], DATA_07[40], DATA_07[41], DATA_07[42], DATA_07[43], DATA_07[44], DATA_07[45], DATA_07[46], DATA_07[47], DATA_07[48], DATA_07[49], DATA_07[50], DATA_07[51], DATA_07[52], DATA_07[53], DATA_07[54], DATA_07[55], DATA_07[56], DATA_07[57], DATA_07[58], DATA_07[59], DATA_07[60], DATA_07[61], DATA_07[62], DATA_07[63], DATA_07[64], DATA_07[65], DATA_07[66], DATA_07[67], DATA_07[68], DATA_07[69], DATA_07[70], DATA_07[71], DATA_07[72], DATA_07[73], DATA_07[74], DATA_07[75], DATA_07[76], DATA_07[77], DATA_07[78], DATA_07[79], DATA_07[80], DATA_07[81], DATA_07[82], DATA_07[83], DATA_07[84], DATA_07[85], DATA_07[86], DATA_07[87], DATA_07[88], DATA_07[89], DATA_07[90], DATA_07[91], DATA_07[92], DATA_07[93], DATA_07[94], DATA_07[95], DATA_07[96], DATA_07[97], DATA_07[98], DATA_07[99], DATA_07[100], DATA_07[101], DATA_07[102], DATA_07[103], DATA_07[104], DATA_07[105], DATA_07[106], DATA_07[107], DATA_07[108], DATA_07[109], DATA_07[110], DATA_07[111], DATA_07[112], DATA_07[113], DATA_07[114], DATA_07[115], DATA_07[116], DATA_07[117], DATA_07[118], DATA_07[119], DATA_07[120], DATA_07[121], DATA_07[122], DATA_07[123], DATA_07[124], DATA_07[125], DATA_07[126], DATA_07[127], DATA_07[128], DATA_07[129], DATA_07[130], DATA_07[131], DATA_07[132], DATA_07[133], DATA_07[134], DATA_07[135], DATA_07[136], DATA_07[137], DATA_07[138], DATA_07[139], DATA_07[140], DATA_07[141], DATA_07[142], DATA_07[143], DATA_07[144], DATA_07[145], DATA_07[146], DATA_07[147], DATA_07[148], DATA_07[149], DATA_07[150], DATA_07[151], DATA_07[152], DATA_07[153], DATA_07[154], DATA_07[155], DATA_07[156], DATA_07[157], DATA_07[158], DATA_07[159], DATA_07[160], DATA_07[161], DATA_07[162], DATA_07[163], DATA_07[164], DATA_07[165], DATA_07[166], DATA_07[167], DATA_07[168], DATA_07[169], DATA_07[170], DATA_07[171], DATA_07[172], DATA_07[173], DATA_07[174], DATA_07[175], DATA_07[176], DATA_07[177], DATA_07[178], DATA_07[179], DATA_07[180], DATA_07[181], DATA_07[182], DATA_07[183], DATA_07[184], DATA_07[185], DATA_07[186], DATA_07[187], DATA_07[188], DATA_07[189], DATA_07[190], DATA_07[191]}),
    .OUT(RGB_4x8x8));
  SPI_TEENSY #(.SPI_FILTER(2)) spi_host_teensy (
    .CLK(PLL_CLK_150MHz), .SPI_CS(T_CS), .SPI_CLK(T_CLK), .SPI_MOSI(T_MOSI), .DATA_TX(di_var_teensy_data),
    .RESET(SPI_RESET_T), .SPI_MISO(T_MISO), .DATA_RX(spi_host_teensy_data_rx));
  WDT #(.DELAY_TIME(250), .RESET_TIME(50), .ENABLE(1'b1)) wdt_teensy (
    .CLK(SYS_CLK), .CLK_1kHz(AIN0), .IN(T_CS), .ENABLE_SPI(1'b1), .RESET(SPI_RESET_T));
  DATA_OUT_VAR_TEENSY do_var_teensy (
    .DATA(spi_host_teensy_data_rx), .TEENSY_TO_FPGA_8BIT_01(T_TO_FPGA_8BIT_01),
    .TEENSY_TO_FPGA_8BIT_02(T_TO_FPGA_8BIT_02), .TEENSY_TO_FPGA_8BIT_03(T_TO_FPGA_8BIT_03),
    .TEENSY_TO_FPGA_8BIT_04(T_TO_FPGA_8BIT_04), .TEENSY_TO_FPGA_8BIT_05(T_TO_FPGA_8BIT_05),
    .TEENSY_TO_FPGA_8BIT_06(T_TO_FPGA_8BIT_06), .TEENSY_TO_FPGA_8BIT_07(T_TO_FPGA_8BIT_07),
    .TEENSY_TO_FPGA_8BIT_08(T_TO_FPGA_8BIT_08), .TEENSY_TO_FPGA_8BIT_09(RPI_TO_FPGA_8BIT_09),
    .TEENSY_TO_FPGA_8BIT_10(RPI_TO_FPGA_8BIT_10), .TEENSY_TO_FPGA_8BIT_11(RPI_TO_FPGA_8BIT_11),
    .TEENSY_TO_FPGA_8BIT_12(RPI_TO_FPGA_8BIT_12), .TEENSY_TO_FPGA_8BIT_13(RPI_TO_FPGA_8BIT_13),
    .TEENSY_TO_FPGA_8BIT_14(RPI_TO_FPGA_8BIT_14), .TEENSY_TO_FPGA_8BIT_15(RPI_TO_FPGA_8BIT_15),
    .TEENSY_TO_FPGA_8BIT_16(RPI_TO_FPGA_8BIT_16), .TEENSY_TO_FPGA_8BIT_17(RPI_TO_FPGA_8BIT_17),
    .TEENSY_TO_FPGA_8BIT_18(RPI_TO_FPGA_8BIT_18), .TEENSY_TO_FPGA_8BIT_19(RPI_TO_FPGA_8BIT_19),
    .TEENSY_TO_FPGA_8BIT_20(RPI_TO_FPGA_8BIT_20), .TEENSY_TO_FPGA_8BIT_21(RPI_TO_FPGA_8BIT_21),
    .TEENSY_TO_FPGA_8BIT_22(RPI_TO_FPGA_8BIT_22), .TEENSY_TO_FPGA_8BIT_23(RPI_TO_FPGA_8BIT_23),
    .TEENSY_TO_FPGA_8BIT_24(RPI_TO_FPGA_8BIT_24), .TEENSY_TO_FPGA_8BIT_25(RPI_TO_FPGA_8BIT_25),
    .TEENSY_TO_FPGA_8BIT_26(RPI_TO_FPGA_8BIT_26), .TEENSY_TO_FPGA_8BIT_27(RPI_TO_FPGA_8BIT_27),
    .TEENSY_TO_FPGA_8BIT_28(RPI_TO_FPGA_8BIT_28), .TEENSY_TO_FPGA_8BIT_29(RPI_TO_FPGA_8BIT_29),
    .TEENSY_TO_FPGA_8BIT_30(RPI_TO_FPGA_8BIT_30), .TEENSY_TO_FPGA_8BIT_31(RPI_TO_FPGA_8BIT_31),
    .TEENSY_TO_FPGA_8BIT_32(RPI_TO_FPGA_8BIT_32), .TEENSY_TO_FPGA_8BIT_33(T_TO_FPGA_8BIT_33),
    .TEENSY_TO_FPGA_16BIT_01(T_TO_FPGA_16BIT_01), .TEENSY_TO_FPGA_16BIT_02(T_TO_FPGA_16BIT_02),
    .TEENSY_TO_FPGA_16BIT_03(T_TO_FPGA_16BIT_03), .TEENSY_TO_FPGA_16BIT_04(T_TO_FPGA_16BIT_04),
    .TEENSY_TO_FPGA_16BIT_05(T_TO_FPGA_16BIT_05), .TEENSY_TO_FPGA_16BIT_06(T_TO_FPGA_16BIT_06),
    .TEENSY_TO_FPGA_16BIT_07(T_TO_FPGA_16BIT_07), .TEENSY_TO_FPGA_16BIT_08(T_TO_FPGA_16BIT_08),
    .TEENSY_TO_FPGA_16BIT_09(T_TO_FPGA_16BIT_09), .TEENSY_TO_FPGA_16BIT_10(T_TO_FPGA_16BIT_10),
    .TEENSY_TO_FPGA_16BIT_11(T_TO_FPGA_16BIT_11), .TEENSY_TO_FPGA_16BIT_12(T_TO_FPGA_16BIT_12),
    .TEENSY_TO_FPGA_16BIT_13(T_TO_FPGA_16BIT_13), .TEENSY_TO_FPGA_16BIT_14(T_TO_FPGA_16BIT_14),
    .TEENSY_TO_FPGA_16BIT_15(T_TO_FPGA_16BIT_15));  // open: TEENSY_TO_FPGA_8BIT_34
  CONST_8 #(.VALUE(1)) version_fpga (.OUT(version_fpga_out));
  BIT8_TO_BYTE di_rpi_blp_01 (
    .IN0(USER_BTN), .IN1(1'b0), .IN2(1'b0), .IN3(1'b0), .IN4(1'b0), .IN5(PIO02), .IN6(PIO01), .IN7(D4),
    .OUT(FPGA_TO_RPI_8BIT_08));
  DATA_IN_VAR_RPI data_in_var_rpi (
    .FPGA_TO_RPI_8BIT_01(version_fpga_out), .FPGA_TO_RPI_8BIT_02(T_TO_FPGA_8BIT_01),
    .FPGA_TO_RPI_8BIT_03(T_TO_FPGA_8BIT_02), .FPGA_TO_RPI_8BIT_04(T_TO_FPGA_8BIT_03),
    .FPGA_TO_RPI_8BIT_05(T_TO_FPGA_8BIT_04), .FPGA_TO_RPI_8BIT_06(T_TO_FPGA_8BIT_05),
    .FPGA_TO_RPI_8BIT_07(T_TO_FPGA_8BIT_06), .FPGA_TO_RPI_8BIT_08(T_TO_FPGA_8BIT_07),
    .FPGA_TO_RPI_8BIT_09(FPGA_TO_RPI_8BIT_08), .FPGA_TO_RPI_16BIT_01(T_TO_FPGA_16BIT_01),
    .FPGA_TO_RPI_16BIT_02(T_TO_FPGA_16BIT_02), .DATA(data_in_var_rpi_data));  // open: FPGA_TO_RPI_16BIT_03, FPGA_TO_RPI_16BIT_04, FPGA_TO_RPI_16BIT_05, FPGA_TO_RPI_16BIT_06, FPGA_TO_RPI_16BIT_07, FPGA_TO_RPI_16BIT_08, FPGA_TO_RPI_16BIT_09, FPGA_TO_RPI_16BIT_10, FPGA_TO_RPI_16BIT_11, FPGA_TO_RPI_16BIT_12, FPGA_TO_RPI_16BIT_13, FPGA_TO_RPI_16BIT_14, FPGA_TO_RPI_16BIT_15, FPGA_TO_RPI_16BIT_16, FPGA_TO_RPI_16BIT_17, FPGA_TO_RPI_16BIT_18, FPGA_TO_RPI_16BIT_19, FPGA_TO_RPI_16BIT_20, FPGA_TO_RPI_16BIT_21, FPGA_TO_RPI_16BIT_22, FPGA_TO_RPI_16BIT_23, FPGA_TO_RPI_16BIT_24, FPGA_TO_RPI_16BIT_25, FPGA_TO_RPI_16BIT_26, FPGA_TO_RPI_16BIT_27
  SPI_RASPBERRY #(.SPI_FILTER(2)) spi_host_rpi_blp (
    .CLK(PLL_CLK_150MHz), .SPI_CS(RPI_CS), .SPI_CLK(RPI_CLK), .SPI_MOSI(RPI_MOSI),
    .DATA_TX(data_in_var_rpi_data), .RESET(SPI_RESET_RPI_BLP), .SPI_MISO_TRI(spi_host_rpi_blp_spi_miso_tri),
    .SPI_MISO(spi_host_rpi_blp_spi_miso), .DATA_RX(spi_host_rpi_blp_data_rx));  // open: SPI_READ, SPI_WRITE
  WDT #(.DELAY_TIME(250), .RESET_TIME(50), .ENABLE(1'b1)) wdt_rpi_blp (
    .CLK(SYS_CLK), .CLK_1kHz(AIN0), .IN(RPI_CS), .ENABLE_SPI(1'b1), .RESET(SPI_RESET_RPI_BLP));
  TRI tri_miso (.IN(spi_host_rpi_blp_spi_miso), .OE(spi_host_rpi_blp_spi_miso_tri), .OUT(RPI_MISO));
  DATA_OUT_VAR_RPI data_out_rpi (
    .DATA(spi_host_rpi_blp_data_rx), .RPI_TO_FPGA_8BIT_01(RPI_TO_FPGA_8BIT_01),
    .RPI_TO_FPGA_8BIT_02(RPI_TO_FPGA_8BIT_02), .RPI_TO_FPGA_8BIT_03(RPI_TO_FPGA_8BIT_03),
    .RPI_TO_FPGA_8BIT_04(RPI_TO_FPGA_8BIT_04), .RPI_TO_FPGA_8BIT_05(RPI_TO_FPGA_8BIT_05),
    .RPI_TO_FPGA_8BIT_06(RPI_TO_FPGA_8BIT_06), .RPI_TO_FPGA_8BIT_07(RPI_TO_FPGA_8BIT_07),
    .RPI_TO_FPGA_8BIT_08(RPI_TO_FPGA_8BIT_08), .RPI_TO_FPGA_16BIT_01(RPI_TO_FPGA_16BIT_0),
    .RPI_TO_FPGA_16BIT_02(RPI_TO_FPGA_16BIT_2), .RPI_TO_FPGA_16BIT_03(RPI_TO_FPGA_16BIT_3),
    .RPI_TO_FPGA_16BIT_04(RPI_TO_FPGA_16BIT_4), .RPI_TO_FPGA_16BIT_05(RPI_TO_FPGA_16BIT_5),
    .RPI_TO_FPGA_16BIT_06(RPI_TO_FPGA_16BIT_6), .RPI_TO_FPGA_16BIT_07(RPI_TO_FPGA_16BIT_7),
    .RPI_TO_FPGA_16BIT_08(RPI_TO_FPGA_16BIT_8), .RPI_TO_FPGA_16BIT_09(RPI_TO_FPGA_16BIT_9),
    .RPI_TO_FPGA_16BIT_10(RPI_TO_FPGA_16BIT_10), .RPI_TO_FPGA_16BIT_11(RPI_TO_FPGA_16BIT_11),
    .RPI_TO_FPGA_16BIT_12(RPI_TO_FPGA_16BIT_12), .RPI_TO_FPGA_16BIT_13(RPI_TO_FPGA_16BIT_13),
    .RPI_TO_FPGA_16BIT_14(RPI_TO_FPGA_16BIT_14), .RPI_TO_FPGA_16BIT_15(RPI_TO_FPGA_16BIT_15),
    .RPI_TO_FPGA_16BIT_16(RPI_TO_FPGA_16BIT_16), .RPI_TO_FPGA_16BIT_17(RPI_TO_FPGA_16BIT_17),
    .RPI_TO_FPGA_16BIT_18(RPI_TO_FPGA_16BIT_18), .RPI_TO_FPGA_16BIT_19(RPI_TO_FPGA_16BIT_19),
    .RPI_TO_FPGA_16BIT_20(RPI_TO_FPGA_16BIT_20), .RPI_TO_FPGA_16BIT_21(RPI_TO_FPGA_16BIT_21),
    .RPI_TO_FPGA_16BIT_22(RPI_TO_FPGA_16BIT_22), .RPI_TO_FPGA_16BIT_23(RPI_TO_FPGA_16BIT_23),
    .RPI_TO_FPGA_16BIT_24(RPI_TO_FPGA_16BIT_24), .RPI_TO_FPGA_16BIT_25(RPI_TO_FPGA_16BIT_25),
    .RPI_TO_FPGA_16BIT_26(RPI_TO_FPGA_16BIT_26), .RPI_TO_FPGA_16BIT_27(RPI_TO_FPGA_16BIT_27));  // open: RPI_TO_FPGA_8BIT_09, RPI_TO_FPGA_8BIT_10, RPI_TO_FPGA_8BIT_11, RPI_TO_FPGA_8BIT_12, RPI_TO_FPGA_8BIT_13, RPI_TO_FPGA_8BIT_14, RPI_TO_FPGA_8BIT_15, RPI_TO_FPGA_8BIT_16, RPI_TO_FPGA_8BIT_17, RPI_TO_FPGA_8BIT_18, RPI_TO_FPGA_8BIT_19, RPI_TO_FPGA_8BIT_20, RPI_TO_FPGA_8BIT_21, RPI_TO_FPGA_8BIT_22, RPI_TO_FPGA_8BIT_23, RPI_TO_FPGA_8BIT_24, RPI_TO_FPGA_8BIT_25, RPI_TO_FPGA_8BIT_26, RPI_TO_FPGA_8BIT_27, RPI_TO_FPGA_8BIT_28, RPI_TO_FPGA_8BIT_29, RPI_TO_FPGA_8BIT_30, RPI_TO_FPGA_8BIT_31, RPI_TO_FPGA_8BIT_32, RPI_TO_FPGA_8BIT_33

  assign AIN4 = AIN0;
  assign AIN5 = AIN1;
  assign AIN6 = AIN2;
  assign AIN7 = AIN3;
  assign BDBUS1 = T_TXD;
  assign D5 = D4;
  assign PIO03 = AIN0;
  assign PIO04 = AIN1;
  assign PIO05 = PIO01;
  assign PIO06 = PIO02;
  assign PIO07 = AIN0;
  assign PIO08 = AIN1;
  assign RGB_8x8 = RGB_4x8x8;
  assign T_RXD = 1'b0;

  // Other names for the same wires on the sheet: CLK_1Hz = PIO02; CLK_1kHz = AIN0; CLK_5Hz = PIO01; CLK_10Hz = D4;
  //   CLK_50Hz = AIN3; CLK_100Hz = AIN2; CLK_500Hz = AIN1; SPI_RPI_CLK = RPI_CLK; SPI_RPI_CS = RPI_CS;
  //   SPI_RPI_MOSI = RPI_MOSI; SPI_T_CS = T_CS; CLK_12MHz = SYS_CLK_12MHz

  // Notes on the sheet:
  //   SPI Ankopplung Raspberry Pi BLP
  //   Phase-locked loop für die Frequenzvervielfachung der Quarzfrequenz
  //   SPI Ankopplung Teensy 4.1
  //   Signalgenerator fuer unterschiedliche Frequenzen
  //   Signalausgabe an die Leuchtdioden
  //   VERLINKUNG TEENSY UART
  //   MIT FPGA UART
  //   RGB Matrix
endmodule
